# Altium schematic sheet LED_Wall [Connectors].SchDoc: CONNECTORS
size Letter
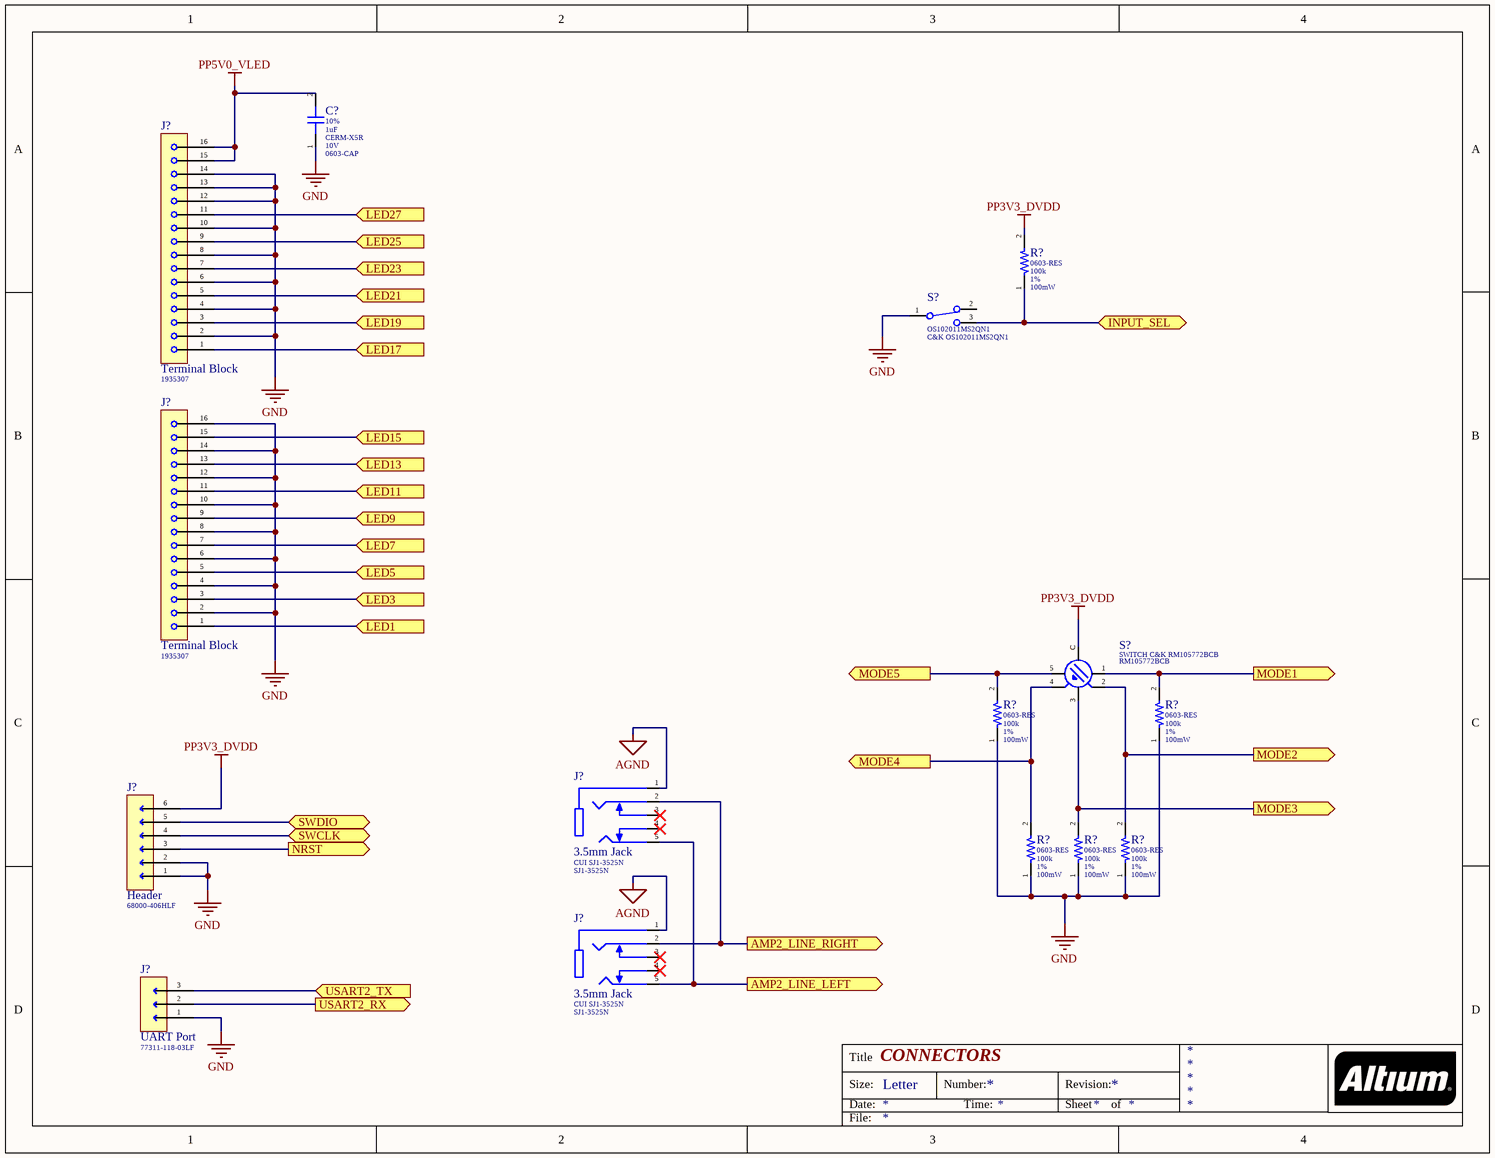
[diagram p0: LED_Wall [Connectors].SchDoc]

## Parts
(Parts that share a designator on the sheet are numbered #1, #2 ... from top to bottom, then left to right.)
C?  Tolerance: 10%  Capacitance: 1uF  Dielectric: CERM-X5R  Voltage: 10V  [0603-CAP]  (hidden comment: CAP SAMSUNG CL10A105KP8NNNC)
J?#1  Terminal Block  Manufacturer Part Number: 1935307  [PHOENIX 1935307]
J?#2  Terminal Block  Manufacturer Part Number: 1935307  [PHOENIX 1935307]
J?#3  Header  Manufacturer Part Number: 68000-406HLF  [HEADER 6POS 1ROW 2.54MM]
J?#4  3.5mm Jack  Manufacturer Part Number: SJ1-3525N  [CUI SJ1-3525N]
J?#5  3.5mm Jack  Manufacturer Part Number: SJ1-3525N  [CUI SJ1-3525N]
J?#6  UART Port  Manufacturer Part Number: 77311-118-03LF  [HEADER 3POS 1ROW 2.54MM]
R?#1  Resistance: 100k  Tolerance: 1%  Power: 100mW  [0603-RES]  (hidden comment: RES BOURNS CR0603AFX-1003EAS)
R?#2  Resistance: 100k  Tolerance: 1%  Power: 100mW  [0603-RES]  (hidden comment: RES BOURNS CR0603AFX-1003EAS)
R?#3  Resistance: 100k  Tolerance: 1%  Power: 100mW  [0603-RES]  (hidden comment: RES BOURNS CR0603AFX-1003EAS)
R?#4  Resistance: 100k  Tolerance: 1%  Power: 100mW  [0603-RES]  (hidden comment: RES BOURNS CR0603AFX-1003EAS)
R?#5  Resistance: 100k  Tolerance: 1%  Power: 100mW  [0603-RES]  (hidden comment: RES BOURNS CR0603AFX-1003EAS)
R?#6  Resistance: 100k  Tolerance: 1%  Power: 100mW  [0603-RES]  (hidden comment: RES BOURNS CR0603AFX-1003EAS)
S?#1  Manufacturer Part Number: OS102011MS2QN1  [C&K OS102011MS2QN1]  (hidden comment: SPDT)
S?#2  Manufacturer Part Number: RM105772BCB  [SWITCH C&K RM105772BCB]  (hidden comment: SWITCH C&K RM105772BCB)

## Ports
AMP2_LINE_LEFT (out), AMP2_LINE_RIGHT (out), INPUT_SEL, LED1 (in), LED3 (in), LED5 (in), LED7 (in), LED9 (in), LED11 (in), LED13 (in), LED15 (in), LED17 (in), LED19 (in), LED21 (in), LED23 (in), LED25 (in), LED27 (in), MODE1 (out), MODE2 (out), MODE3 (out), MODE4 (out), MODE5 (out), NRST (out), SWCLK (bidir), SWDIO (bidir), USART2_RX (out), USART2_TX (in)

## Nets
AGND: J?#4.1 J?#5.1
GND: C?.1 J?#1.2 J?#1.4 J?#1.6 J?#1.8 J?#1.10 J?#1.12 J?#1.13 J?#1.14 J?#2.2 J?#2.4 J?#2.6 J?#2.8 J?#2.10 J?#2.12 J?#2.14 J?#2.16 J?#3.1 J?#3.2 J?#6.1 R?#2.1 R?#3.1 R?#4.1 R?#5.1 R?#6.1 S?#1.1
PP3V3_DVDD: J?#3.6 R?#1.2 S?#2.C
PP5V0_VLED: C?.2 J?#1.15 J?#1.16
AMP2_LINE_LEFT: J?#4.5 J?#5.5 ; port AMP2_LINE_LEFT
AMP2_LINE_RIGHT: J?#4.2 J?#5.2 ; port AMP2_LINE_RIGHT
INPUT_SEL: R?#1.1 S?#1.3 ; port INPUT_SEL
LED1: J?#2.1 ; port LED1
LED3: J?#2.3 ; port LED3
LED5: J?#2.5 ; port LED5
LED7: J?#2.7 ; port LED7
LED9: J?#2.9 ; port LED9
LED11: J?#2.11 ; port LED11
LED13: J?#2.13 ; port LED13
LED15: J?#2.15 ; port LED15
LED17: J?#1.1 ; port LED17
LED19: J?#1.3 ; port LED19
LED21: J?#1.5 ; port LED21
LED23: J?#1.7 ; port LED23
LED25: J?#1.9 ; port LED25
LED27: J?#1.11 ; port LED27
MODE1: R?#3.2 S?#2.1 ; port MODE1
MODE2: R?#6.2 S?#2.2 ; port MODE2
MODE3: R?#5.2 S?#2.3 ; port MODE3
MODE4: R?#4.2 S?#2.4 ; port MODE4
MODE5: R?#2.2 S?#2.5 ; port MODE5
NRST: J?#3.3 ; port NRST
SWCLK: J?#3.4 ; port SWCLK
SWDIO: J?#3.5 ; port SWDIO
USART2_RX: J?#6.2 ; port USART2_RX
USART2_TX: J?#6.3 ; port USART2_TX

Not connected (* = marked no-connect by the designer): J?#4 3* 4*; J?#5 3* 4*; S?#1 2(0)

## Notes on the sheet
- Title
- Size:
- Date:
- Letter
- Number:
- Time:
- Revision:
- Sheet
- of
- File:

## Library data of the parts
C? = CAP SAMSUNG CL10A105KP8NNNC: CAP CER 1UF 10V X5R 0603; Supplier 1: Digi-Key; Manufacturer: Samsung; Manufacturer Part Number: CL10A105KP8NNNC; Stock 1: 4040315; Pricing 1: 1=0.1, 10=0.036, 100=0.0161, 500=0.0115, 1000=0.0091 (USD); Mount: Surface Mount; Case/Package: 0603; Case Code (Metric): 1608; Case Code (Imperial): 0603; Contact Plating: Tin; Min Operating Temperature: -55°C; Max Operating Temperature: 85°C; Packaging: Tape and Reel; Package Quantity: 1; Voltage Rating: 10V; Length: 1.6mm; Height: 0.8mm; Width: 0.031inch; Thickness: 0.035inch; Depth: 0.8mm; Radiation Hardening: No; ComponentLink1URL: https://www.verical.com/server-webapp/html/getDatasheet?partID=358616&src-supplier=Verical; ComponentLink1Description: https://www.verical.com/server-webapp/html/getDatasheet?partID=358616&src-supplier=Verical; ComponentLink2URL: http://www1.futureelectronics.com/doc/SAMSUNG%20PASSIVE/CL05B104KQ5NNNC.pdf?src-supplier=Future+Electronics; ComponentLink2Description: http://www1.futureelectronics.com/doc/SAMSUNG%20PASSIVE/CL05B104KQ5NNNC.pdf?src-supplier=Future+Electronics; Supplier Part Number 1: 1276-1182-1-ND; CurrentFootprint: 0603-CAP
J?#1 J?#2 = CONN PHOENIX 1935307: TERM BLK 16P SIDE ENTRY 5MM PCB; Manufacturer: Phoenix Contact; Current Rating: 17.5A; Voltage Rating: 250V; Max Current Rating: 16A; Number of Positions: 16; Number of Levels: 1; Current: 18A; Voltage: 300V; Wire Gauge (Max): 26AWG; Wire Gauge (Min): 12AWG; Wire/Cable Gauge: 14AWG; Supplier 1: Digi-Key; Stock 1: 672; Pricing 1: 1=3.1, 10=3.011, 50=2.814, 100=2.5889, 250=2.3919 (USD); Mount: Through Hole; Weight: 0.543924oz; Material: Nylon; Color: Green; Housing Color: Green; Housing Material: Polyamide; Package Quantity: 50; Packaging: Bulk; Termination: Solder; Orientation: Straight; Number of Rows: 1; Max Supply Voltage: 250V; Number of Positions Per Level: 16; Number of Contacts: 16; Number of Circuits: 16; Length: 80mm; Height: 11.3mm; Pitch: 5mm; Depth: 9mm; Radiation Hardening: No; Lead Free: Lead Free; Flammability Rating: UL94 V-0; ComponentLink1URL: https://www.verical.com/server-webapp/html/getDatasheet?partID=376815&src-supplier=Verical; ComponentLink1Description: https://www.verical.com/server-webapp/html/getDatasheet?partID=376815&src-supplier=Verical; ComponentLink2URL: https://media.digikey.com/pdf/Data%20Sheets/Phoenix%20Contact%20PDFs/1935307.pdf?src-supplier=Digi-Key; ComponentLink2Description: https://media.digikey.com/pdf/Data%20Sheets/Phoenix%20Contact%20PDFs/1935307.pdf?src-supplier=Digi-Key; ComponentLink3URL: http://components.arrow.com/part/dataview/43946543S9087763N1555?src-supplier=Arrow; ComponentLink3Description: http://components.arrow.com/part/dataview/43946543S9087763N1555?src-supplier=Arrow; Supplier Part Number 1: 277-1591-ND
J?#3 = HEADER AMPHENOL 68000-406HLF: CONN HEADER VERT 6POS 2.54MM; Manufacturer: Amphenol FCI; Voltage Rating: 1.5kV; Number of Positions: 6; Connector Type: Male Pin; Current Rating: 3A; Gender: Male; Insulation Resistance: 5GR; Contact Post Length: 2.41mm; Supplier 1: Digi-Key; Stock 1: 17288; Pricing 1: 1=0.27, 10=0.252, 100=0.1745, 500=0.1476, 1000=0.1208, 5000=0.1074, 10000=0.0973 (USD); Mount: Through Hole; Contact Plating: Tin; Contact Material: Bronze; Color: Black; Housing Color: Black; Housing Material: Thermoplastic; Min Operating Temperature: -65°C; Max Operating Temperature: 125°C; Packaging: Bulk; Number of Rows: 1; Package Quantity: 100; Termination: Solder; Number of Contacts: 6; Max Voltage Rating (AC): 1.5kV; Orientation: Straight; Contact Gender: Male; Length: 15.24mm; Pitch: 2.54mm; Depth: 2.41mm; Contact Mating Length: 0.23inch; Radiation Hardening: No; REACH SVHC: No SVHC; Flammability Rating: UL94 V-0; ComponentLink1URL: https://cdn.amphenol-icc.com/media/wysiwyg/files/drawing/68000.pdf?src-supplier=Digi-Key; ComponentLink1Description: https://cdn.amphenol-icc.com/media/wysiwyg/files/drawing/68000.pdf?src-supplier=Digi-Key; Supplier Part Number 1: 609-3263-ND
J?#4 J?#5 = CONN CUI SJ1-3525N: CONN JACK STEREO 3.5MM R/A; Manufacturer: CUI; Connector Type: Phone Jack; Gender: Female; Industry Recognized Mating Diameter: 3.50mm (0.141", 1/8", Mini Plug) - Headphone; Actual Diameter: 0.142" (3.60mm); Number of Positions/Contacts: 3 Conductors, 5 Contacts; Internal Switch(s): Two Switches; Shielding: Unshielded; Voltage - Rated: 12VDC; Current Rating: 1A; Mating Length/Depth: 0.551" (14.00mm); Body Material: Brass; Body Color: Silver, Black; Includes: 1 pc - 1 Connector; Supplier 1: Digi-Key; Supplier Part Number 1: CP1-3525N-ND; Stock 1: 5474; Pricing 1: 1=0.76, 10=0.668, 25=0.6288, 50=0.6026, 100=0.5764, 250=0.524, 500=0.4716, 1000=0.4192, 2500=0.3799 (USD); Category: Connectors, Interconnects; Family: Barrel - Audio Connectors; Series: SJ1; Packaging: Bulk; Signal Lines: Stereo; Mounting Type: Through Hole, Right Angle; Termination: Solder; Features: -; Insulation Color: -; Contact Material - Plating: Tin; ComponentLink1URL: https://www.cui.com/product/resource/digikeypdf/sj1-352xn_series.pdf?src-supplier=Digi-Key; ComponentLink1Description: https://www.cui.com/product/resource/digikeypdf/sj1-352xn_series.pdf?src-supplier=Digi-Key; CurrentFootprint: CUI SJ1-3525N
J?#6 = HEADER AMPHENOL 77311-118-03LF: CONN HEADER VERT 3POS 2.54MM; Manufacturer: Amphenol FCI; Number of Contacts: 3; Max Voltage Rating (AC): 1.5kV; Gender: Male; Connector Type: Male Pin; Current Rating: 3A; Insulation Resistance: 5GR; Contact Post Length: 3.05mm; Supplier 1: Digi-Key; Stock 1: 0; Pricing 1: 1=0.21, 10=0.197, 100=0.1362, 500=0.1153, 1000=0.0943, 5000=0.0838, 10000=0.076 (USD); Mount: Through Hole; Contact Plating: Gold,GXT; Contact Material: Bronze; Color: Black; Housing Color: Black; Housing Material: Thermoplastic; Material: Thermoplastic; Min Operating Temperature: -65°C; Max Operating Temperature: 125°C; Number of Rows: 1; Termination: Solder; Packaging: Bulk; Package Quantity: 1000; Number of Positions: 3; Orientation: Straight; Voltage Rating: 1.5kV; Contact Gender: Male; Length: 7.62mm; Pitch: 2.54mm; Depth: 2.4mm; Contact Mating Length: 0.23inch; Radiation Hardening: No; Lead Free: Lead Free; REACH SVHC: No SVHC; Flammability Rating: UL94 V-0; ComponentLink1URL: http://www.farnell.com/datasheets/52620.pdf?src-supplier=Element14; ComponentLink1Description: http://www.farnell.com/datasheets/52620.pdf?src-supplier=Element14; ComponentLink2URL: http://portal.fciconnect.com/Comergent/fci/drawing/77311.pdf?src-supplier=Avnet; ComponentLink2Description: http://portal.fciconnect.com/Comergent/fci/drawing/77311.pdf?src-supplier=Avnet; ComponentLink3URL: http://portal.fciconnect.com/Comergent//fci/drawing/77311.pdf?src-supplier=Digi-Key; ComponentLink3Description: http://portal.fciconnect.com/Comergent//fci/drawing/77311.pdf?src-supplier=Digi-Key; Supplier Part Number 1: 609-5680-ND
R?#1-R?#6 = RES BOURNS CR0603AFX-1003EAS: RESA-AS 0603 100K 1% 100MW TC100; Supplier 1: Digi-Key; Manufacturer: Bourns; Manufacturer Part Number: CR0603AFX-1003EAS; Stock 1: 4900; Pricing 1: 1=0.1, 10=0.075, 100=0.0307, 1000=0.0138, 2500=0.012 (USD); Supplier Part Number 1: CR0603AFX-1003EASCT-ND; Current Footprint: 0603-RES
S?#1 = SWITCH C&K OS102011MS2QN1: SWITCH SLIDE SPDT 100MA 12V; Manufacturer: ITT C&K; Product Training Modules: Introduction to Electromechanical Switches; Catalog Drawings: OSxxxxxMS2Q Series; 3D Model: OS102011MS2QN1.stp OS102011MS2QN1.pdf; Contact Timing: Non-Shorting (BBM); Switch Function: On-On; Current Rating: 100mA (DC); Actuator Type: Standard; Actuator Length: 4.00mm; Actuator Material: Polyoxymethylene (Acetal) (POM); Switch Travel: 2.00mm; Mechanical Life: 10,000 Cycles; Online Catalog: OS Series; Other Names: *OS102011MS2QN1 0S102011MS2QN1 0S102011MS2QN1-ND CKN9565 OS102011MS2QN1-ND Q1132318; Supplier 1: Digi-Key; Stock 1: 36919; Pricing 1: 1=0.43, 10=0.413, 25=0.4048, 50=0.3616, 100=0.3444, 250=0.3358, 500=0.2841, 1000=0.2755, 5000=0.2411 (USD); Standard Package: 300; Category: Switches; Family: Slide Switches; Series: OS; Packaging: Bulk; Circuit: SPDT; Voltage Rating - AC: -; Voltage Rating - DC: 12V; Contact Material: Copper Alloy; Contact Finish: Silver; Mounting Type: Through Hole; Termination Style: PC Pin; Features: Epoxy Sealed Terminals; Operating Temperature: -30°C ~ 70°C; Electrical Life: 10,000 Cycles; Operating Force: -; ComponentLink1URL: http://www.farnell.com/datasheets/2044662.pdf?src-supplier=Element14; ComponentLink1Description: http://www.farnell.com/datasheets/2044662.pdf?src-supplier=Element14; ComponentLink2URL: https://www.ckswitches.com/media/1428/os.pdf?src-supplier=Digi-Key; ComponentLink2Description: https://www.ckswitches.com/media/1428/os.pdf?src-supplier=Digi-Key; ComponentLink3URL: http://uk.rs-online.com/webdocs/1263/0900766b81263f61.pdf?src-supplier=RSComponents; ComponentLink3Description: http://uk.rs-online.com/webdocs/1263/0900766b81263f61.pdf?src-supplier=RSComponents; ComponentLink4URL: http://www.farnell.com/datasheets/2674787.pdf?src-supplier=Newark; ComponentLink4Description: http://www.farnell.com/datasheets/2674787.pdf?src-supplier=Newark; ComponentLink5URL: https://www.verical.com/server-webapp/html/getDatasheet?partID=320490&src-supplier=Verical; ComponentLink5Description: https://www.verical.com/server-webapp/html/getDatasheet?partID=320490&src-supplier=Verical; ComponentLink6URL: https://www.alliedelec.com/m/d/08271ccc8b1809c6b911a7d3c93f3e8a.pdf?src-supplier=Allied+Electronics; ComponentLink6Description: https://www.alliedelec.com/m/d/08271ccc8b1809c6b911a7d3c93f3e8a.pdf?src-supplier=Allied+Electronics; ComponentLink7URL: http://www1.futureelectronics.com/doc/C%20&%20K%20COMPONENTS/OS102011MS2QN1.pdf?src-supplier=Future+Electronics; ComponentLink7Description: http://www1.futureelectronics.com/doc/C%20&%20K%20COMPONENTS/OS102011MS2QN1.pdf?src-supplier=Future+Electronics; Supplier Part Number 1: CKN9565-ND; Current Footprint: C&K OS102011MS2QN1
S?#2 = SWITCH C&K RM105772BCB: SWITCH ROTARY 5POS 500MA 24V; Manufacturer: ITT C&K; Categories: Switches; Number of Positions: 5; Index Stops: Fixed; Number of Decks: 1; Circuit per Deck: SP5T; Contact Timing: Non-Shorting (BBM); Current Rating: 500mA (DC); Actuator Type: Flatted (4.2mm Dia), Slotted; Actuator Length: 7.70mm; Angle of Throw: 45°; Operating Force: 2.700gfm; Supplier 1: Digi-Key; Supplier Part Number 1: CKN10701-ND; Stock 1: 258; Pricing 1: 1=2.74, 5=2.474, 10=2.312, 25=2.1192, 50=1.9774, 100=1.8607, 250=1.7035, 500=1.5971, 1000=1.4957 (USD); Series: RM; Part Status: Active; Number of Poles per Deck: 1; Voltage Rating - DC: 24V; Contact Material: Brass; Contact Finish: Gold; Mounting Type: Through Hole; Termination Style: PC Pin; Features: -; Depth Behind Panel: 7.37mm; Panel Cutout Dimensions: -; ComponentLink1URL: https://www.ckswitches.com/media/1910/rm.pdf?src-supplier=Digi-Key; ComponentLink1Description: https://www.ckswitches.com/media/1910/rm.pdf?src-supplier=Digi-Key; Current Footprint: SWITCH C&K RM105772BCB